# EAGLE design RJ_IGVC_Estop (EAGLE 9.3.1)
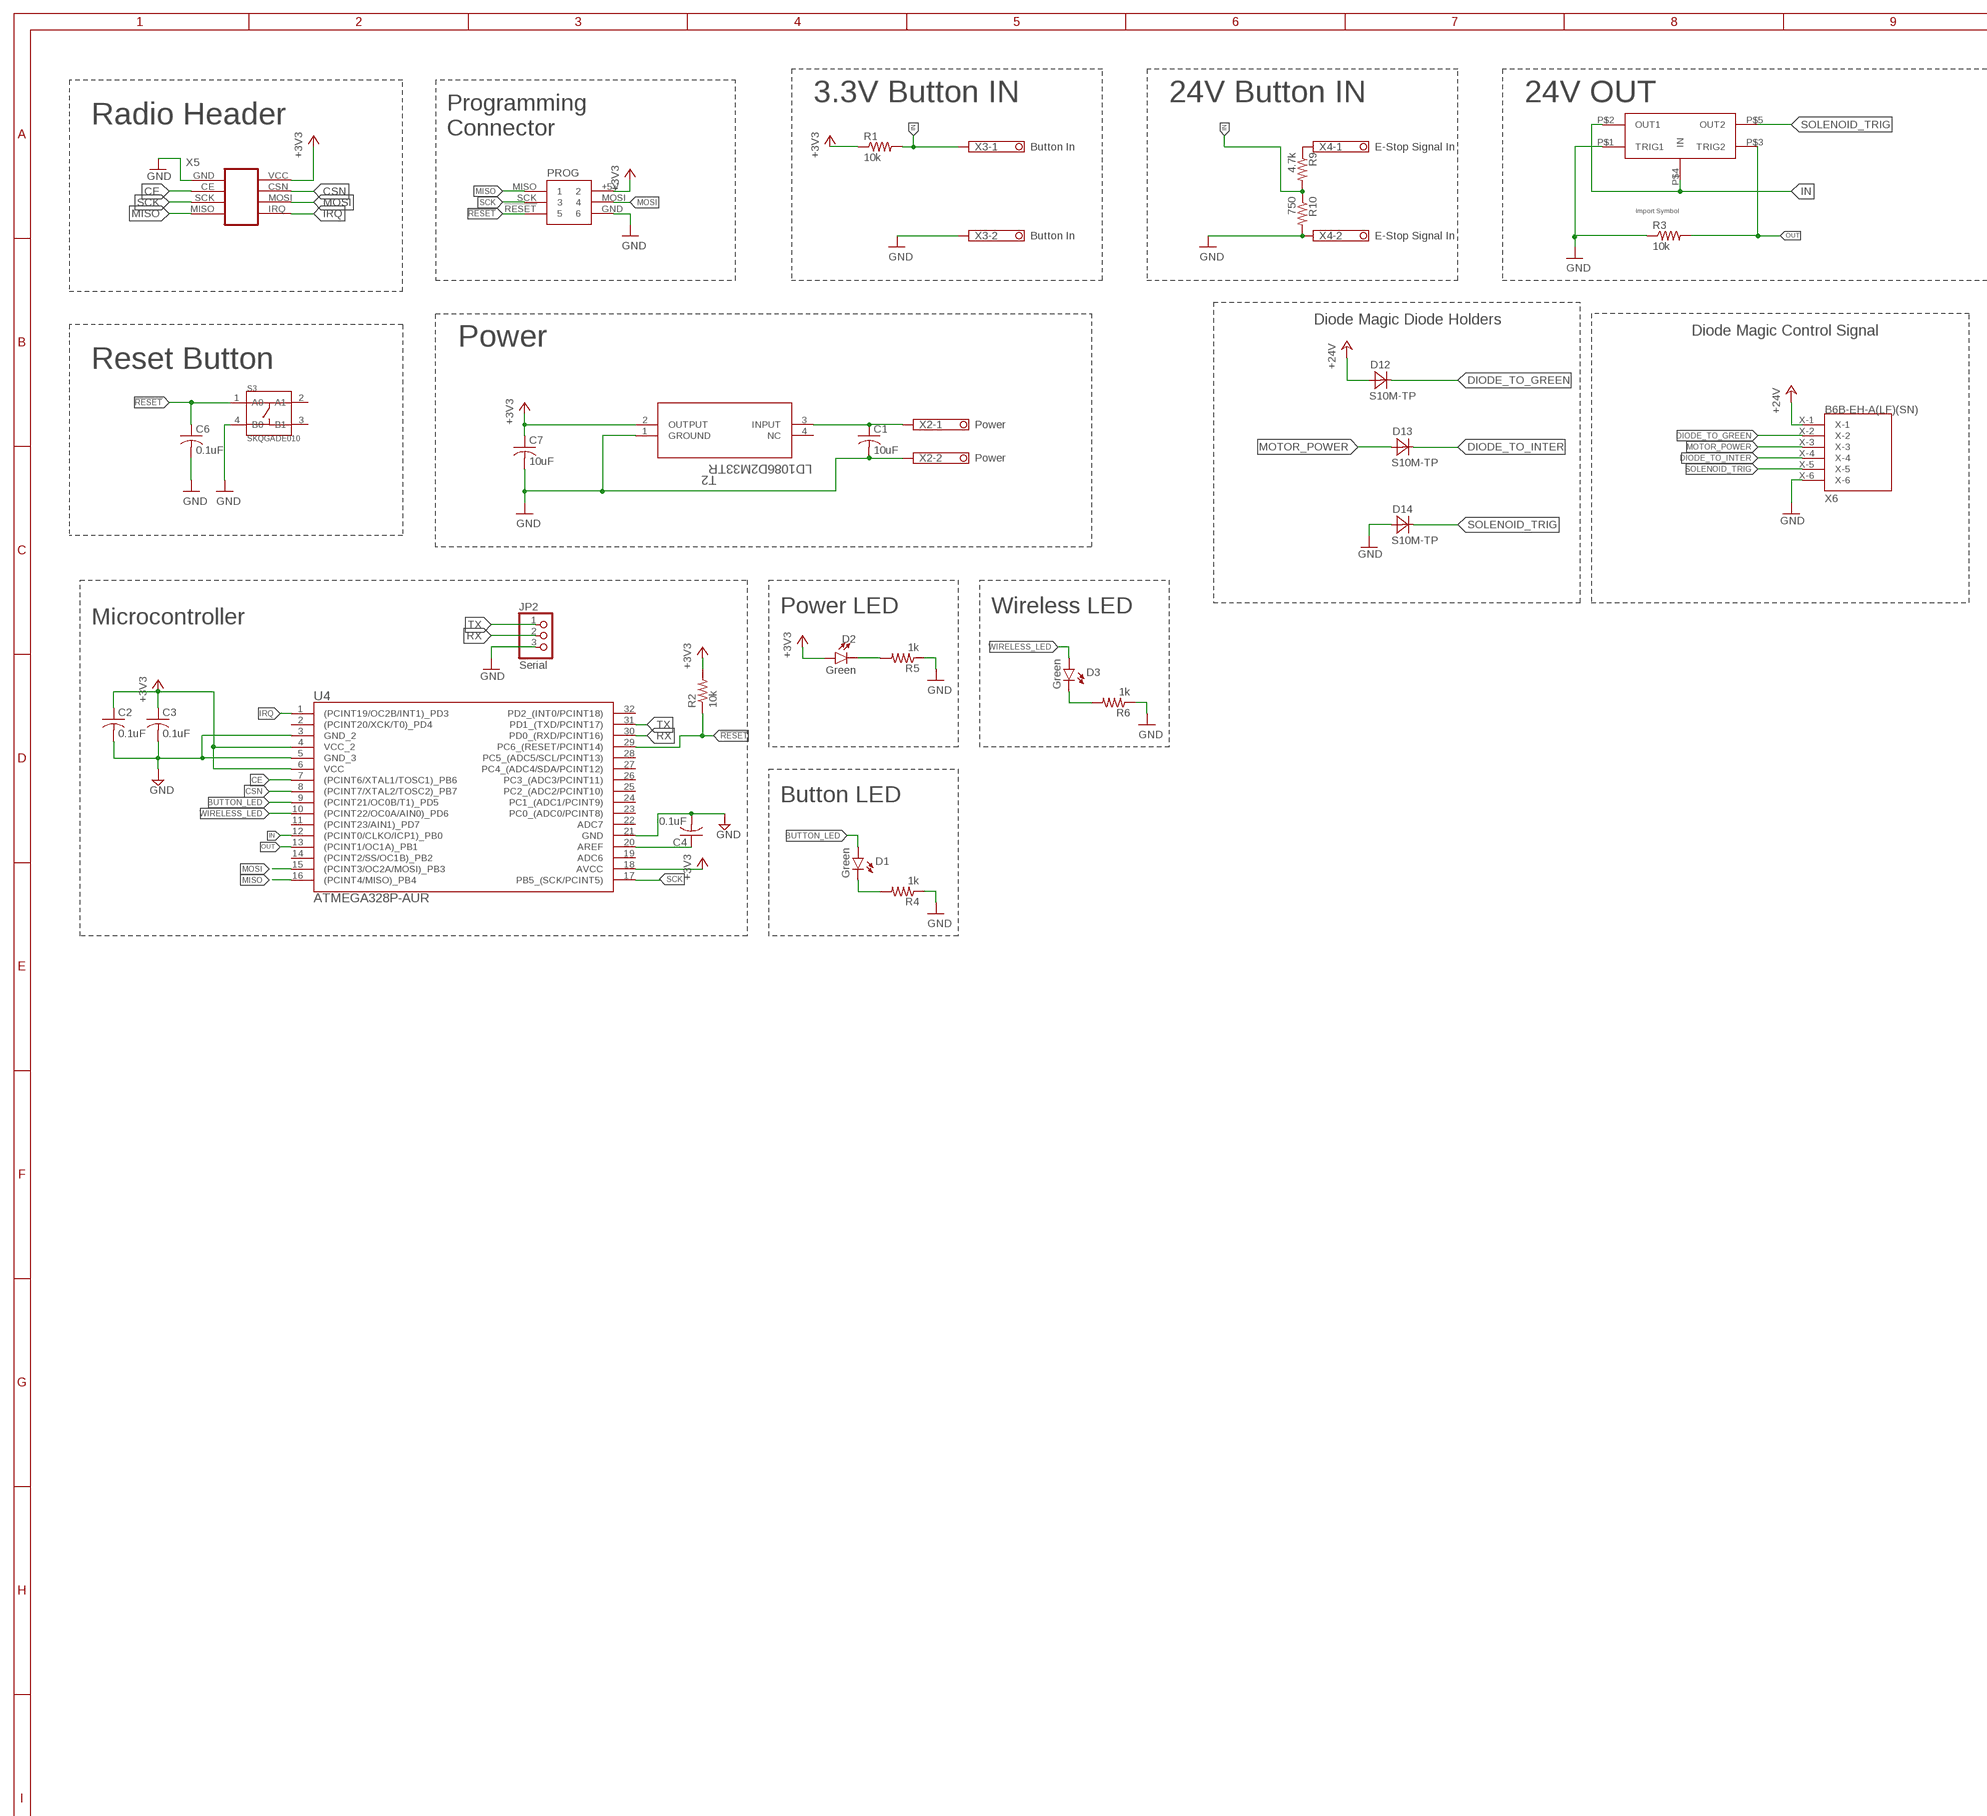
[diagram p0: schematic, sheet 1, part 1 of 2]
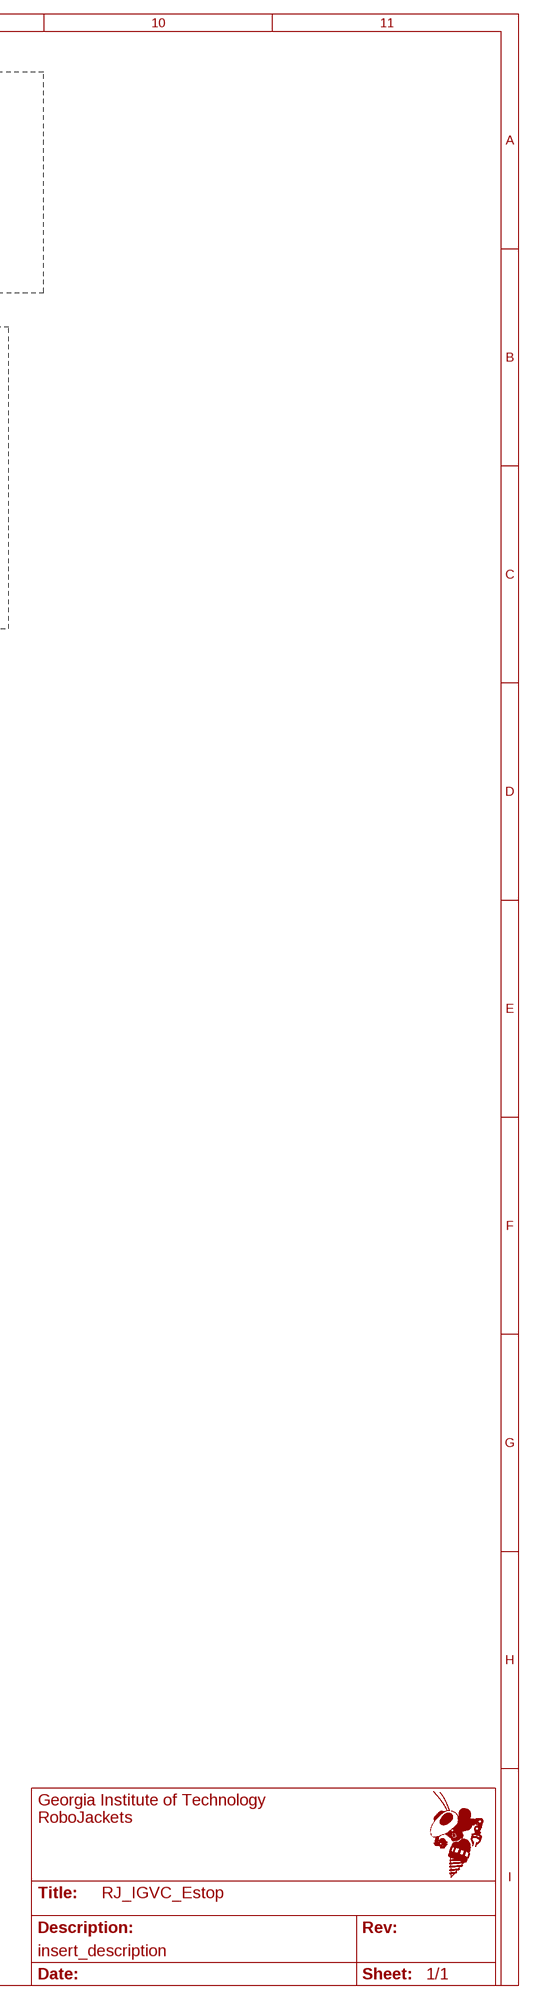
[diagram p1: schematic, sheet 1, part 2 of 2]
FRAME1 (FRAME_C_L): SCH_DESC: insert_description

## Parts
C1  10uF  C-USC1206  [C1206]
C2  0.1uF  C-USC0603  [C0603]
C3  0.1uF  C-USC0603  [C0603]
C4  0.1uF  C-USC0603  [C0603]
C6  0.1uF  C-USC0603  [C0603]
C7  10uF  C-USC1206  [C1206]
D1  Green  LED-YELLOW0603  [LED-0603]
D2  Green  LED-YELLOW0603  [LED-0603]
D3  Green  LED-YELLOW0603  [LED-0603]
D12  S10M-TP  [SMC]
D13  S10M-TP  [SMC]
D14  S10M-TP  [SMC]
JP2  Serial  PINHD-1X3  [1X03]
PROG  ICSP Connector  2X3SHROUDED  [2X3SHROUDED]
R1  10k  R-US_R0603  [R0603]
R2  10k  R-US_R0603  [R0603]
R3  10k  R-US_R0603  [R0603]
R4  1k  R-US_R0603  [R0603]
R5  1k  R-US_R0603  [R0603]
R6  1k  R-US_R0603  [R0603]
R9  4.7k  R-US_R0603  [R0603]
R10  750  R-US_R0603  [R0603]
S3  SKQGADE010  SMD-SWITCH-TOP-260GF(4P-D5.2MM)  [SW4-SMD-5.2X5.2X1.5MM]
T2  LD1086D2M33TR  [D2PAK/A]
U4  ATMEGA328P-AUR  [ATMEGA328P-AUR]
U$1  G5LE-14  [G5LE-14]
X2  Power  1751248  [1751248]
X3  Button In  1751248  [1751248]
X4  E-Stop Signal In  1751248  [1751248]
X5  NRF24L01+PA+LNA  [NRF24L01+PA+LNA]
X6  B6B-EH-A(LF)(SN)  [B6BEHALFSN]

## Nets
!RESET: C6.1 PROG.!RESET R2.1 S3.1(A0) U4.29(PC6_(RESET/PCINT14))
+3V3: C2.1 C3.1 C7.1 D2.A PROG.+5V R1.1 R2.2 T2.2(OUTPUT) U4.4(VCC_2) U4.6(VCC) U4.18(AVCC) X5.VCC
+24V: D12.A X6.X-1
BUTTON_LED: D1.A U4.9((PCINT21/OC0B/T1)_PD5)
CE: U4.7((PCINT6/XTAL1/TOSC1)_PB6) X5.CE
CSN: U4.8((PCINT7/XTAL2/TOSC2)_PB7) X5.CSN
DIODE_TO_GREEN: D12.C X6.X-2
DIODE_TO_INTER: D13.C X6.X-4
GND: C1.2 C2.2 C3.2 C4.2 C6.2 C7.2 D14.A JP2.3 PROG.GND R3.1 R4.1 R5.1 R6.1 R10.2 S3.4(B0) T2.1(GROUND) U4.3(GND_2) U4.5(GND_3) U4.21(GND) U$1.P$1(TRIG1) X2.2 X3.2 X4.2 X5.GND X6.X-6
IN: R1.2 R9.2 R10.1 U4.12((PCINT0/CLKO/ICP1)_PB0) U$1.P$2(OUT1) U$1.P$4(IN) X3.1
IRQ: U4.1((PCINT19/OC2B/INT1)_PD3) X5.IRQ
MISO: PROG.MISO U4.16((PCINT4/MISO)_PB4) X5.MISO
MOSI: PROG.MOSI U4.15((PCINT3/OC2A/MOSI)_PB3) X5.MOSI
MOTOR_POWER: D13.A X6.X-3
N$2: D2.C R5.2
N$3: D1.C R4.2
N$4: D3.C R6.2
N$6: R9.1 X4.1
N$9: C4.1 U4.20(AREF)
OUT: R3.2 U4.13((PCINT1/OC1A)_PB1) U$1.P$3(TRIG2)
RX: JP2.2 U4.30(PD0_(RXD/PCINT16))
SCK: PROG.SCK U4.17(PB5_(SCK/PCINT5)) X5.SCK
SOLENOID_TRIG: D14.C U$1.P$5(OUT2) X6.X-5
TX: JP2.1 U4.31(PD1_(TXD/PCINT17))
V_IN: C1.1 T2.3(INPUT) X2.1
WIRELESS_LED: D3.A U4.10((PCINT22/OC0A/AIN0)_PD6)
Unconnected: S3.2(A1) S3.3(B1) T2.4(NC) U4.2((PCINT20/XCK/T0)_PD4) U4.11((PCINT23/AIN1)_PD7) U4.14((PCINT2/SS/OC1B)_PB2) U4.19(ADC6) U4.22(ADC7) U4.23(PC0_(ADC0/PCINT8)) U4.24(PC1_(ADC1/PCINT9)) U4.25(PC2_(ADC2/PCINT10)) U4.26(PC3_(ADC3/PCINT11)) U4.27(PC4_(ADC4/SDA/PCINT12)) U4.28(PC5_(ADC5/SCL/PCINT13)) U4.32(PD2_(INT0/PCINT18))

## Notes on the sheet
- 3.3V Button IN | 24V Button IN | 24V OUT
- Radio Header
- Programming
  Connector
- Import Symbol
- Diode Magic Diode Holders
- Diode Magic Control Signal
- Power
- Reset Button
- Power LED | Wireless LED
- Microcontroller
- Button LED

## Library data of the parts
C1-C4 C7 = rcl:C-US: CAPACITOR, American symbol; SPICEPREFIX: C
C6 = resistor:C-US: CAPACITOR, American symbol
D1-D3 = SparkFun-LED:LED-YELLOW: Yellow SMD LED Used in manufacturing several products at SparkFun. Packages: 0603 - SMD 0603 package[Product Link] <http://www.kingbrightusa.com/product.asp?catalog_name=LED&product_id=APT1608SYCK> 0603 -SMART - SMART SMD 0603 package (more efficient/more expensive) [Product Link] <http://www.osram-os.com/osram_os/en/products/product-catalog/led-light-emitting-diodes/smartled-0603/ly-l29k/index.jsp> LilyPad - SMD1206 package[Product Datasheet] <https://www.sparkfun.com/datasheets/DevTools/LilyPad/Q150YUS4.pdf> SparkFun Products: Blynk Board <https://www.sparkfun.com/products/13794> IOIO-OTG <https://www.sparkfun.com/products/13613> XBee Explorer Serial <https://www.sparkfun.com/products/13225>; PROD_ID: DIO-09003; VALUE: Yellow
D12-D14 = IGVC-Discrete:S10M-TP
JP2 = pinhead:PINHD-1X3: PIN HEADER
PROG = lcd-buzzer:2X3SHROUDED
R1 R3-R6 R9 R10 = resistor:R-US_: RESISTOR, American symbol
R2 = rcl:R-US_: RESISTOR, American symbol; SPICEPREFIX: R
S3 = rgb-led:SMD-SWITCH-TOP-260GF(4P-D5.2MM): 311020017; MPN: SKQGADE010
T2 = transistor:LD1086D2M33TR; MANUFACTURER_PART_NUMBER: LD1086D2M33TR; VENDOR: STMicroelectronics
U4 = lcd-buzzer:ATMEGA328P-*
U$1 = IGVC-Misc:G5LE-14
X2-X4 = con-phoenix-350:1751248: MKDS 1/ 2-3,5 Printklemme Nennstrom: 10 A Bemessungsspannung: 160 V Raster: 3,5 mm Polzahl: 2 Montageart: Löten Anschlussart: Schraubanschluss Anschlussrichtung vom Leiter zur Platine: 0° Source: http://eshop.phoenixcontact.com .. 1751248.pdf; OC_FARNELL: unknown; OC_NEWARK: unknown
X5 = IGVC-Connector:NRF24L01+PA+LNA: NRF24L01+PA+LNA
X6 = IGVC-Connector:B6B-EH-A(LF)(SN)

## Board
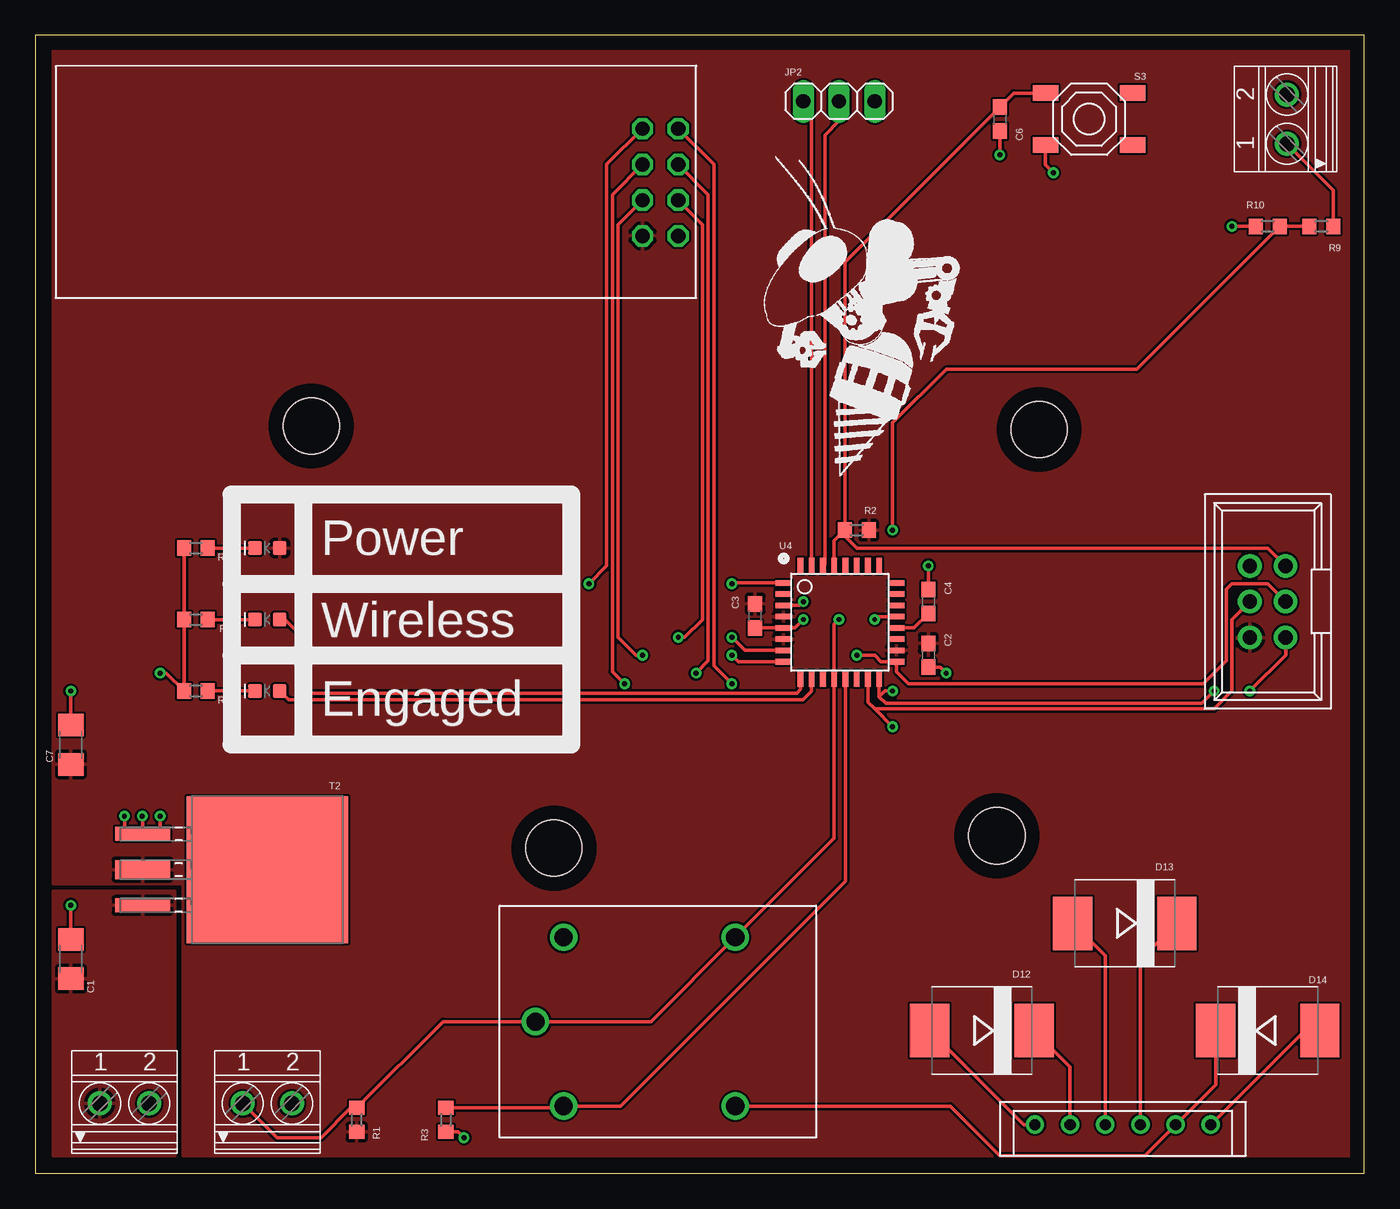
[diagram p2: board, top side]
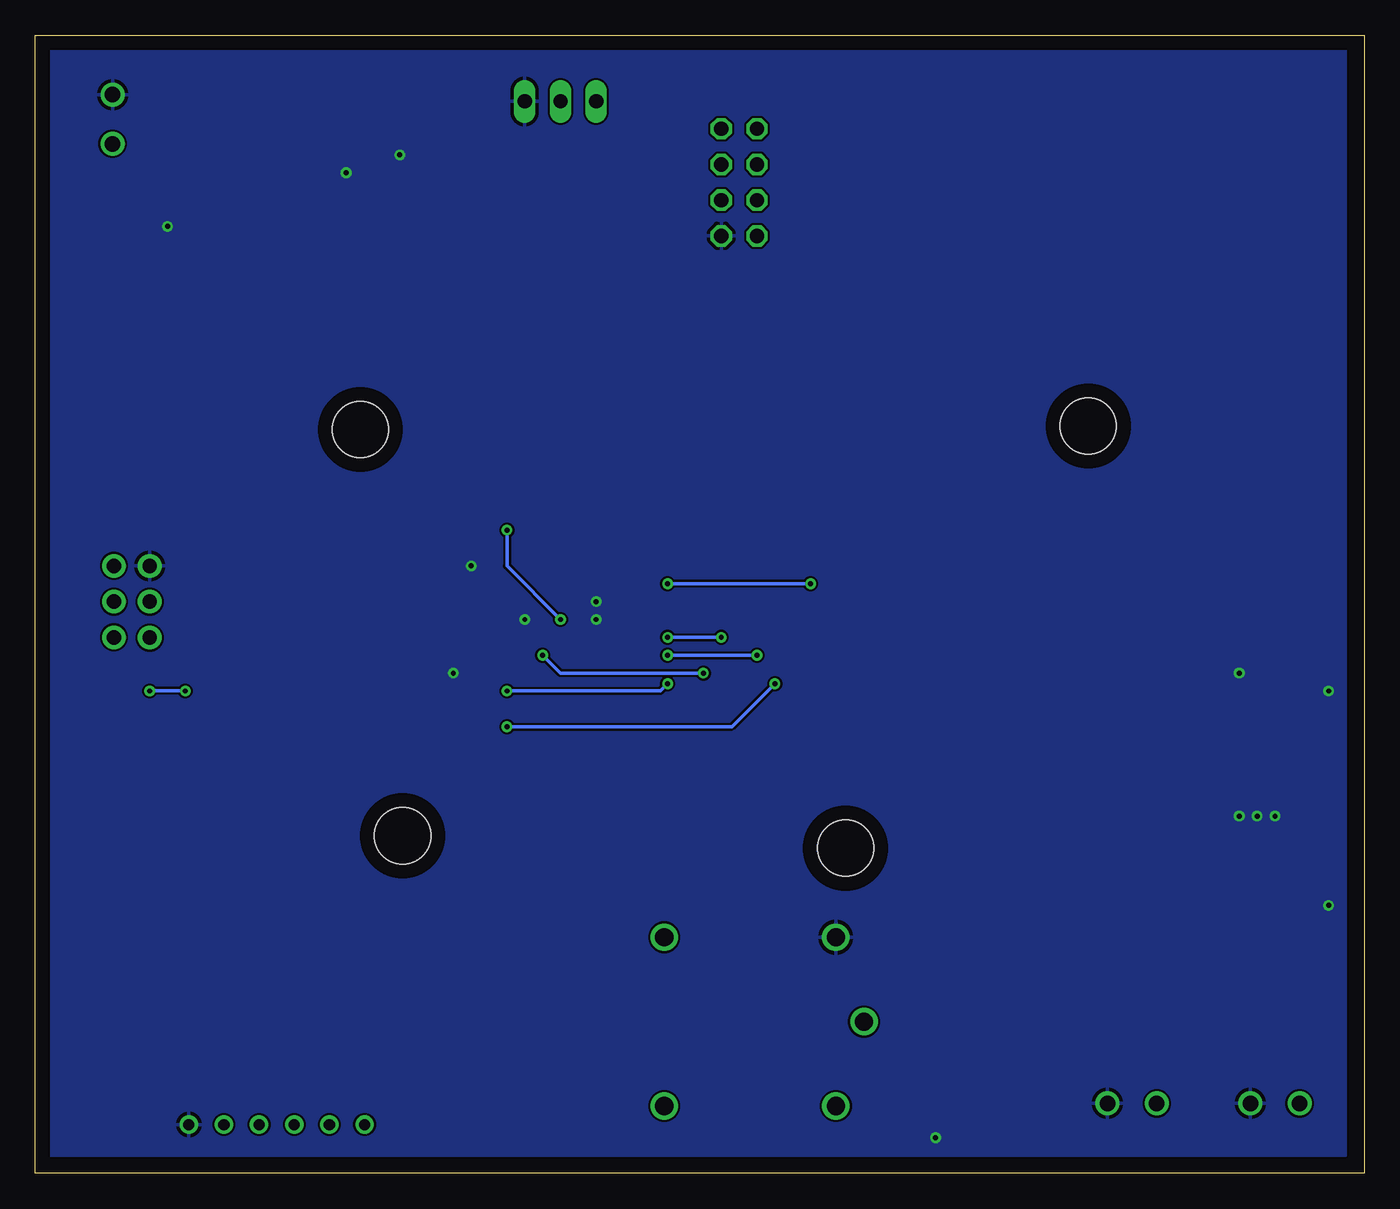
[diagram p3: board, bottom side, seen from below]

Size 94.5 x 80.9 mm. Coordinates in mm from the lower left corner, seen from the top.
Outline: 0,0 94.5,0 94.5,80.9 0,80.9 0,0
Copper layers (1*16): Top 0.035mm / dielectric 1.5mm / Bottom 0.035mm
Design rules "default *": minimum track width 6mil, minimum drill 0.35mm, track to track 6mil, track to pad 6mil, pad to pad 6mil, via to via 6mil, smd to smd 6mil, copper to edge 40mil, drill to drill 6mil, minimum pad ring 10mil, minimum via ring 8mil, stop-mask expansion 4mil, vias tented up to drill 0mil, thermal gap 10mil
Holes 4 mm at 36.88,23.12 68.38,24 19.63,53.12 71.38,52.88

### Footprints (pad centres in the part's own frame; a part is rotated, then mirrored left to right if it is on the bottom)
C1206 = smd 1.6 x 1.8: 1 -1.4,0; 2 1.4,0
C0603 = smd 1.1 x 1: 1 -0.85,0; 2 0.85,0
LED-0603 = smd 1 x 1: A -0.877,0; C 0.877,0
SMC = smd 2.8 x 3.8: A 3.7,0; C -3.7,0
1X03 = drill 1.016 long: 1 -2.54,0; 2 0,0; 3 2.54,0
2X3SHROUDED = drill 1.02 pad 1.676: !RESET -2.54,1.27; +5V 2.554,-1.27; GND -2.54,-1.27; MISO 2.54,1.27; MOSI 0,-1.27; SCK 0,1.27
R0603 = smd 1 x 1.1: 1 -0.85,0; 2 0.85,0
SW4-SMD-5.2X5.2X1.5MM = smd 1.8 x 1.1: 1 -3.1,1.85; 2 3.1,1.85; 3 3.1,-1.85; 4 -3.1,-1.85
D2PAK/A = smd 0.991 x 3.912: 1 -2.54,-8.877; 3 2.54,-8.877 | smd 1.346 x 3.912: 2 0,-8.877 | smd 10.465 x 11.455: 4 0,0
ATMEGA328P-AUR = smd 1.15 x 0.4: 1 -3.946,2.603; 2 -3.955,1.803; 3 -3.955,1.003; 4 -3.955,0.203; 5 -3.955,-0.597; 6 -3.955,-1.397; 7 -3.955,-2.197; 8 -3.955,-2.997; 17 4.085,-2.997; 18 4.085,-2.197; 19 4.085,-1.397; 20 4.085,-0.597; 21 4.085,0.203; 22 4.085,1.003; 23 4.085,1.803; 24 4.085,2.603 | smd 0.4 x 1.15: 9 -2.743,-4.21; 10 -1.943,-4.21; 11 -1.143,-4.207; 12 -0.343,-4.21; 13 0.457,-4.21; 14 1.257,-4.207; 15 2.057,-4.207; 16 2.857,-4.207; 25 2.857,3.813; 26 2.057,3.813; 27 1.257,3.813; 28 0.457,3.811; 29 -0.343,3.811; 30 -1.143,3.813; 31 -1.943,3.811; 32 -2.743,3.811
G5LE-14 = drill 1.3: P$1 4.55,14.25; P$2 16.75,14.25; P$3 4.55,2.25; P$4 2.55,8.25; P$5 16.75,2.25
1751248 = drill 1.1 pad 1.7: 1 -1.75,-0.1; 2 1.75,-0.1
NRF24L01+PA+LNA = drill 1.016 octagon: CE 21.59,-0.68; CSN 19.05,-0.68; GND 21.59,-3.22; IRQ 19.05,4.4; MISO 21.59,4.4; MOSI 19.05,1.86; SCK 21.59,1.86; VCC 19.05,-3.22
B6BEHALFSN = drill 0.8: X-1 2.5,2.2; X-2 5,2.2; X-3 7.5,2.2; X-4 10,2.2; X-5 12.5,2.2; X-6 15,2.2

### Placement (x,y rotation side)
C1  2.54,15.24 90 top
C2  63.5,36.83 270 top
C3  51.18,39.62 270 top
C4  63.5,40.64 90 top
C6  68.58,74.93 270 top
C7  2.54,30.48 90 top
D1  16.51,39.37 180 top
D2  16.51,44.45 180 top
D3  16.51,34.29 180 top
D12  67.31,10.16 180 top
D13  77.47,17.78 180 top
D14  87.63,10.16 0 top
JP2  57.15,76.2 0 top
PROG  87.63,40.64 270 top
R1  22.86,3.81 90 top
R2  58.42,45.72 0 top
R3  29.21,3.81 90 top
R4  11.43,39.37 0 top
R5  11.43,44.45 0 top
R6  11.43,34.29 0 top
R9  91.44,67.31 180 top
R10  87.63,67.31 180 top
S3  74.93,74.93 0 top
T2  16.51,21.59 270 top
U4  57.15,39.37 0 top
U$1  33.02,2.54 0 top
U$2  [ROBOBUZZ_1.2X]  57.15,49.53 0 top
X2  6.35,5.08 0 top
X3  16.51,5.08 0 top
X4  88.9,74.93 90 top
X5  24.13,69.85 0 top
X6  68.58,1.27 0 top

### Tracks (layer width: path | path; a pad name or v marks a point on that pad's centre or on a via)
!RESET
  Top 0.254: U4.29 56.81,44.96 R2.1 | R2.1 57.57,64.77 C6.1 69.58,76.78 S3.1 | R2.1 57.57,45.3 58.42,44.45 87.63,44.45 PROG.!RESET
+3V3
  pour Top: 1.27,20.57 10.54,20.57 10.54,1.27 93.98,1.27 93.98,80.01 1.27,80.01
+24V
  Top 0.254: D12.A 70.3,3.47 X6.X-1
BUTTON_LED
  Top 0.254: U4.9 54.41,34.4 54.15,34.15 19.58,34.15 19.05,34.67 19.05,38.1 17.78,39.37 D1.A
CE  (via drill 0.35)
  Top 0.254: X5.CE 47.45,67.44 47.45,39.37 46.18,38.1 v45.72,38.1 | U4.7 50.46,37.17 v49.53,38.1
  Bottom 0.254: v49.53,38.1 v45.72,38.1
CSN  (via drill 0.35)
  Top 0.254: X5.CSN 41.45,67.44 41.45,38.1 42.72,36.83 v43.18,36.83 | U4.8 49.99,36.37 v49.53,36.83
  Bottom 0.254: v49.53,36.83 v43.18,36.83
DIODE_TO_GREEN
  Top 0.254: D12.C 73.58,7.59 X6.X-2
DIODE_TO_INTER
  Top 0.254: D13.C 78.58,15.19 X6.X-4
GND  (via drill 0.35)
  Top 0.254: v8.89,35.56 9.31,35.56 R6.1 R4.1 R5.1 | C1.2 v2.54,19.05 | 7.63,24.14 T2.1 7.63,25.4 v7.62,25.4 | C7.2 v2.54,34.29 | R3.1 30.06,2.96 v30.48,2.54 | C6.2 v68.58,72.39 | S3.4 71.83,71.68 v72.39,71.12 | R10.2 v85.09,67.31 | C2.2 64.35,35.98 v64.77,35.56 | U4.21 59.89,39.57 v59.69,39.37 | U4.3 54.34,40.37 v54.61,40.64 | v54.61,39.37 54.01,38.77 U4.5 C3.2 | v6.35,25.4 6.35,24.13 | v8.89,25.4 8.89,24.13 | X6.X-6 90.27,10.16 D14.A | C4.2 v63.5,43.18
  pour Bottom: 1.27,80.01 93.98,80.01 93.98,1.27 1.27,1.27
IN  (via drill 0.35)
  Top 0.254: X3.1 17.2,2.54 20.32,2.54 22.44,4.66 R1.2 28.99,10.79 U$1.P$4 43.77,10.79 U$1.P$2 56.81,23.83 U4.12 56.81,39.03 v57.15,39.37 | R9.2 R10.1 78.32,57.15 64.77,57.15 60.96,53.34 v60.96,45.72
  Bottom 0.254: v60.96,45.72 60.96,43.18 v57.15,39.37
IRQ  (via drill 0.35)
  Top 0.254: X5.IRQ 40.64,71.71 40.64,43.18 v39.37,41.91 | v49.53,41.91 49.59,41.97 U4.1
  Bottom 0.254: v39.37,41.91 v49.53,41.91
MISO  (via drill 0.35)
  Top 0.254: 60.01,33.89 60.47,33.43 82.96,33.43 v83.82,34.29 | U4.16 60.01,33.89 | v86.36,34.29 88.9,36.83 PROG.MISO | X5.MISO 48.26,71.71 48.26,36.07 v49.53,34.8 | 60.01,33.89 60.4,34.29 v60.96,34.29
  Bottom 0.254: v83.82,34.29 v86.36,34.29 | v60.96,34.29 50.04,34.29 v49.53,34.8
MOSI  (via drill 0.35)
  Top 0.254: U4.15 59.21,33.5 59.69,33.02 | 59.69,33.02 83.82,33.02 85.09,34.29 85.09,39.37 PROG.MOSI | X5.MOSI 41.05,69.58 41.05,35.67 v41.91,34.8 | v60.96,31.75 59.69,33.02
  Bottom 0.254: v60.96,31.75 44.96,31.75 v41.91,34.8
MOTOR_POWER
  Top 0.254: X6.X-3 76.08,15.47 D13.A
N$2
  Top 0.254: R5.2 D2.C
N$3
  Top 0.254: R4.2 D1.C
N$4
  Top 0.254: R6.2 D3.C
N$6
  Top 0.254: X4.1 92.29,69.89 R9.1
N$9
  Top 0.254: U4.20 62.48,38.77 C4.1
OUT
  Top 0.254: R3.2 37.44,4.66 U$1.P$3 41.62,4.79 57.61,20.78 U4.13
RX
  Top 0.254: JP2.2 57.15,74.8 56.13,73.79 56.13,43.31 U4.30
SCK  (via drill 0.35)
  Top 0.254: PROG.SCK 87.63,41.91 85.09,41.91 84.68,41.5 84.68,36.42 83.06,34.8 62.1,34.8 61.23,35.67 U4.17 60.15,36.37 59.69,36.83 v58.42,36.83 | X5.SCK 47.85,69.58 47.85,36.42 v46.99,35.56
  Bottom 0.254: v46.99,35.56 57.15,35.56 v58.42,36.83
SOLENOID_TRIG
  Top 0.254: U$1.P$5 65.06,4.79 68.58,1.27 78.88,1.27 X6.X-5 83.93,6.32 D14.C
TX
  Top 0.254: U4.31 55.21,75.6 JP2.1
V_IN
  pour Top: 1.27,20.07 9.91,20.07 9.91,1.27 1.27,1.27
WIRELESS_LED
  Top 0.254: D3.A 18.02,33.66 54.58,33.66 55.21,34.28 U4.10

### Text on the board
tPlace: Power | Wireless | Engaged
tValues: IGVC E-Stop Board / v1.1